# Altium schematic sheet Power.SchDoc
size A4; SheetNumber: 1; SheetTotal: 9; SPICEModelCacheXSTPFURH: <root> / <DocumentId>XSTPFURH</DocumentId> / <CacheFrame Number="0"> / <Model Name="1206_156120rs82500" Kind="CKT"> / <Text>****** / .subckt 1206_156120RS82500  1  2 / D1 1 2 SMRW / .MODEL SMRW D / + IS=404.38E-18 / + N=2.1466 / + RS=.75545 / + IKF=193.03E-6 / + CJO=1.0000E-12 / + M=.3333 / + VJ=.75 / + BV=5 / + IBV=100.00E-6 / + TT=5.0000E-9 / .ends</Text> / </Model> / </CacheFrame> / </root>
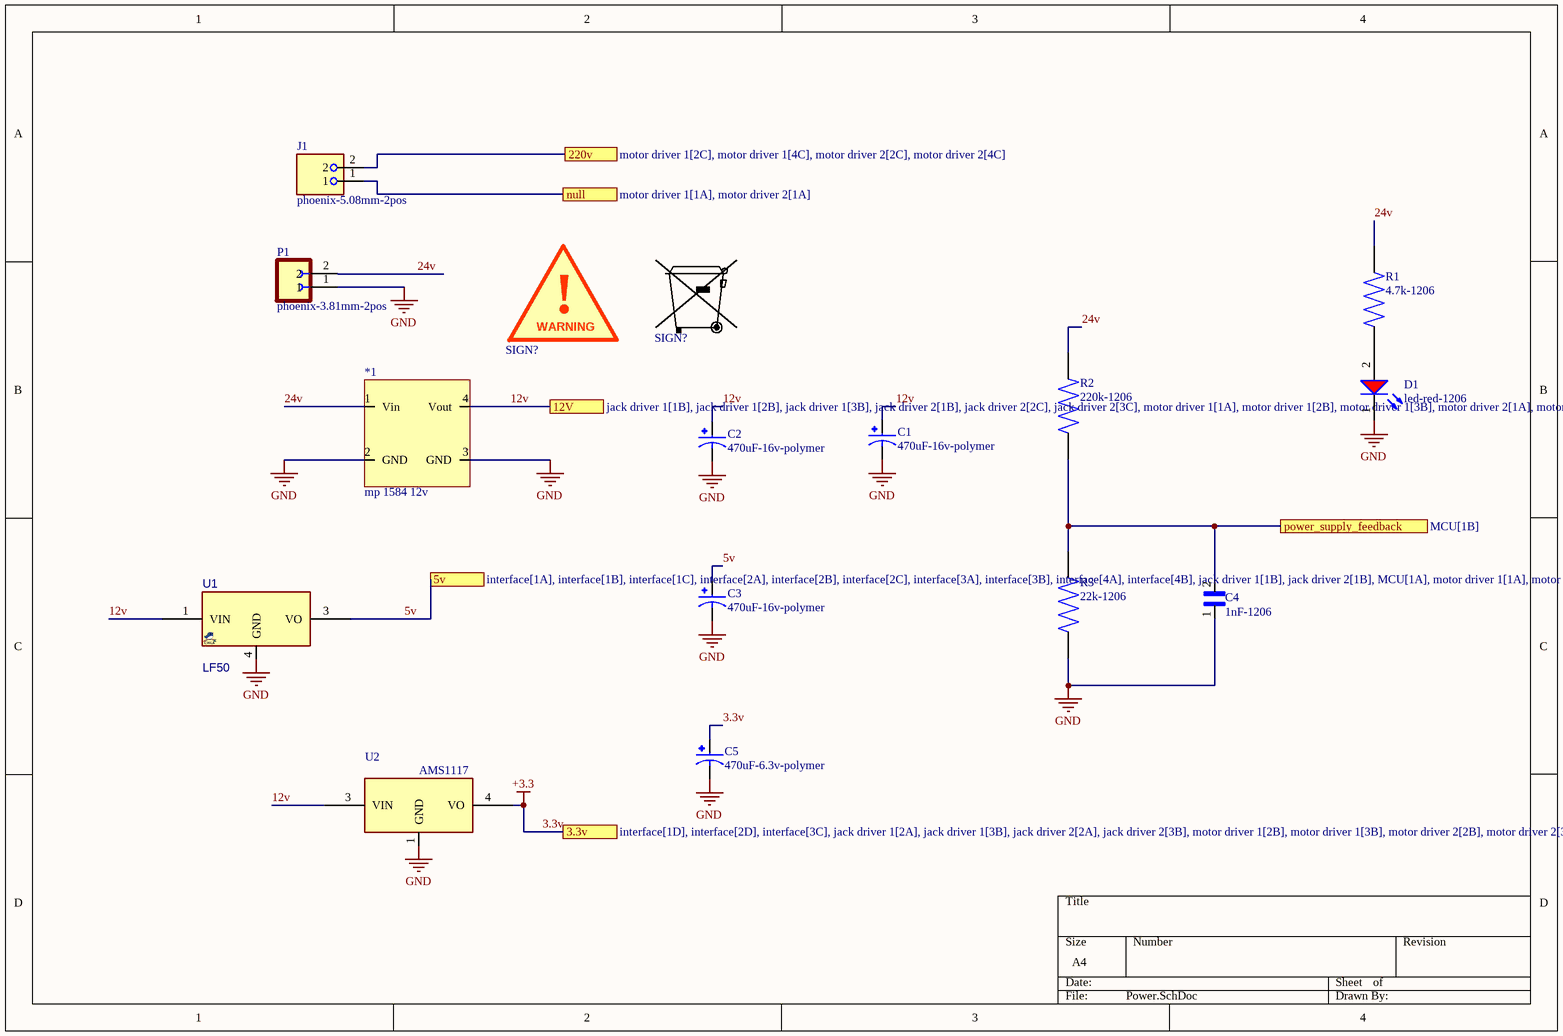
[diagram p0: Power.SchDoc]

## Parts
(Parts that share a designator on the sheet are numbered #1, #2 ... from top to bottom, then left to right.)
*1  mp 1584 12v  [PCBComponent_1]
C1  470uF-16v-polymer  [CAP_EEEFN1H101L]
C2  470uF-16v-polymer  [CAP_EEEFN1H101L]
C3  470uF-16v-polymer  [CAP_EEEFN1H101L]
C4  1nF-1206  [CAPC3216X180N]
C5  470uF-6.3v-polymer  [CAP_EEEFN1H101L]
D1  led-red-1206  [WL-SMRW_1206 dome_normal use]
J1  phoenix-5.08mm-2pos  [PHOENIX_1715721]
P1  phoenix-3.81mm-2pos  [PHOENIX_1803578]
R1  4.7k-1206  [RESC3015X65N]
R2  220k-1206  [RESC3015X65N]
R3  22k-1206  [RESC3015X65N]
SIGN?#1  Recycle-bin  [SIGN_RECBIN1]  (value not drawn)  (graphical)
SIGN?#2  WARNING  [SIGN_WARNING]  (value not drawn)  (graphical)
U1  LF50  [DPAK_3]
U2  AMS1117  [DPAK_3]  (value not drawn)

## Ports
3.3v (see interface[1D], interface[2D], interface[3C], jack driver 1[2A], jack driver 1[3B], jack driver 2[2A], jack driver 2[3B], motor driver 1[2B], motor driver 1[3B], motor driver 2[2B], motor driver 2[3B], receiver 1[2A], receiver 1[2C], receiver 1[4A], receiver 1[4C], receiver 2[2A], receiver 2[2C], receiver 2[4A], receiver 2[4C]), 5v (see interface[1A], interface[1B], interface[1C], interface[2A], interface[2B], interface[2C], interface[3A], interface[3B], interface[4A], interface[4B], jack driver 1[1B], jack driver 2[1B], MCU[1A], motor driver 1[1A], motor driver 2[1A]), 12V (see jack driver 1[1B], jack driver 1[2B], jack driver 1[3B], jack driver 2[1B], jack driver 2[2C], jack driver 2[3C], motor driver 1[1A], motor driver 1[2B], motor driver 1[3B], motor driver 2[1A], motor driver 2[2B], motor driver 2[3B]), 220v (see motor driver 1[2C], motor driver 1[4C], motor driver 2[2C], motor driver 2[4C]), null (see motor driver 1[1A], motor driver 2[1A]), power_supply_feedback (see MCU[1B])

## Nets
3.3v: C5.1 U2.4(VO) ; port 3.3v  [also labelled +3.3]
GND: *1.2(GND) *1.3(GND) C1.2 C2.2 C3.2 C4.1 C5.2 D1.1(K) P1.1 R3.1 U1.4(GND) U2.1(GND)
5v: C3.1 U1.3(VO) ; port 5v
12v: *1.4(Vout) C1.1 C2.1 U1.1(VIN) U2.3(VIN) ; port 12V
24v: *1.1(Vin) P1.2 R1.2 R2.2
220v: J1.2 ; port 220v
null: J1.1 ; port null
power_supply_feedback: C4.2 R2.1 R3.2 ; port power_supply_feedback
NetD1_2: D1.2(A) R1.1

## Notes on the sheet
- (in symbol SIGN_WARNING) !

## Library data of the parts
*1 = Component_1
C1-C3 C5 = EEEFN1H101L: CAP ALUM 100UF 20% 50V SMD; MF: Panasonic; SnapEDA_Link: https://www.snapeda.com/parts/EEEFN1H101L/Panasonic/view-part/?ref=snap; Package: RADIAL-2 Panasonic; Value: *; MP: EEEFN1H101L; Check_prices: https://www.snapeda.com/parts/EEEFN1H101L/Panasonic/view-part/?ref=eda
C4 = CGA5L3X8R1H105M160AB: 1ÂµF Â±20% 50V Ceramic Capacitor X8R 1206 (3216 Metric); MF: TDK; Value: *; Purchase-URL: https://pricing.snapeda.com/search/part/CGA5L3X8R1H105M160AB/?ref=eda; Package: 3216 TDK; Availability: In Stock; SnapEDA_Link: https://www.snapeda.com/parts/CGA5L3X8R1H105M160AB/TDK/view-part/?ref=snap; MP: CGA5L3X8R1H105M160AB; Check_prices: https://www.snapeda.com/parts/CGA5L3X8R1H105M160AB/TDK/view-part/?ref=eda; Price: None
D1 = 156120RS82500: WL-SMRW Mono-color Reverse mount Waterclear, SMT, size 1206 dome, Red, 2V, 20°; Manufacturer: Wurth Elektronik; Chip Technology: AlInGaP; Dominant Wavelength: 624nm; Luminous Intensity: 1100mcd; Peak Wavelength: 632nm; Manufacturer Part Number: 156120RS82500; Category: Signal LEDs; Match Code: WL-SMRW; ComponentLink1Description: Website Link; ComponentLink1URL: https://www.we-online.com/redexpert/article/156120RS82500?ad; ComponentLink2Description: Datasheet Link; ComponentLink2URL: https://www.we-online.com/redexpert/spec/156120RS82500?ad; Mount: Surface Mount; Operating Temperature Max: 85°C; Operating Temperature Min: -40°C; Packaging: Tape and Reel; Case/Size Code: 1206 dome; Length: 3.2mm; Width: 1.6mm; Height: 1.85mm; Emitting Color: Red; Forward Voltage: 2V; Viewing Angle: 20°
J1 = 1715721: Package: None; Price: None; Value: *; MP: 1715721; Availability: Unavailable
P1 = 1803578: 2 Position Terminal Block Plug, Female Sockets 0.150 (3.81mm) 180Â° Free Hanging (In-Line); MF: Phoenix Contact; Price: None; Purchase-URL: https://pricing.snapeda.com/search/part/1803578/?ref=eda; Availability: Good; SnapEDA_Link: https://www.snapeda.com/parts/1803578/Phoenix%20Contact/view-part/46882/?ref=snap; MP: 1803578; Value: *; Check_prices: https://www.snapeda.com/parts/1803578/Phoenix%20Contact/view-part/46882/?ref=eda; Package: Custom Package Phoenix Contact
R1-R3 = CPF1206B10KE1: Res Thin Film 1206 10K Ohm 0.1% 1/8W Â±25ppm/Â°C Molded SMD SMD Paper T/R; Power_Rating: .125 W; MF: TE Connectivity; Voltage_Rating: 150 V; Tolerance: .1%; SnapEDA_Link: https://www.snapeda.com/parts/CPF1206B10KE1/TE+Connectivity/view-part/?ref=snap; Package: 1206; Resistance: 10K; Value: *; MP: CPF1206B10KE1; EU_RoHS_Compliance: Compliant; Check_prices: https://www.snapeda.com/parts/CPF1206B10KE1/TE+Connectivity/view-part/?ref=eda
SIGN?#1 = SIGN_RECBIN1: SIGN, Recycle-bin, 6x5mm; ASSEMBLY: DNP; VALUE: Recycle-bin
SIGN?#2 = SIGN_WARNING: SIGN, WARNING, 12X12mm; ASSEMBLY: DNP; VALUE: WARNING
U1 = VREG_LFXX_TO252: REG, Linear, LDO0.45V, 0.5A, TO-252; MANF_P#: LF33CDT; MANF: ST; PARAM: LDO0.45V, 0.5A,  82dB@120Hz; PARAM2: 1.5/1.8/2.5/3.3/5V; PRICE: 1500t; VALUE: LF50
U2 = VREG_AMS1117_DPACK3